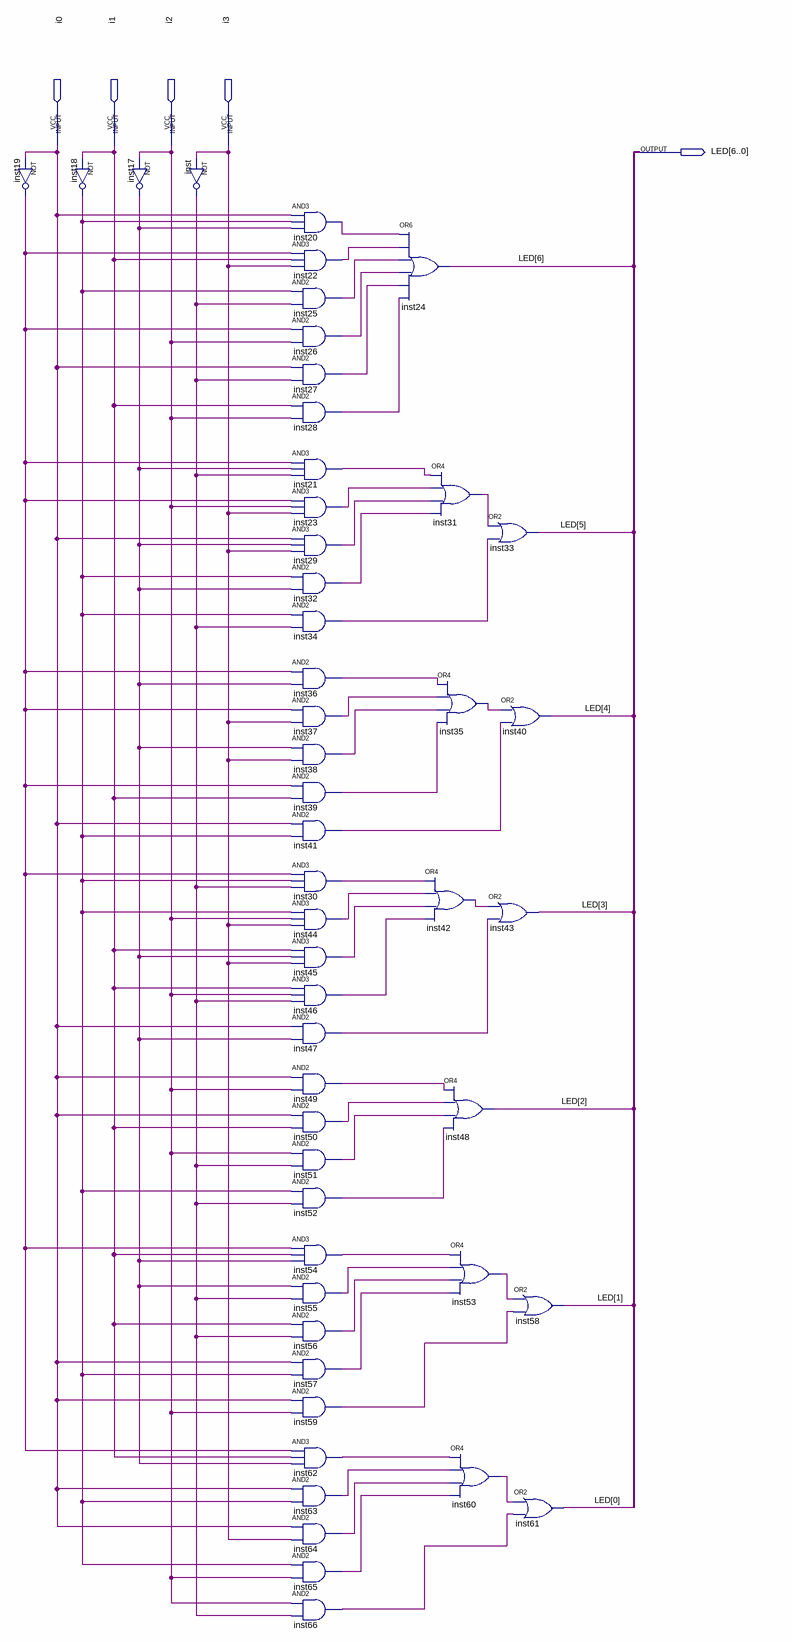
[diagram p0: schematic sheet]
// Quartus schematic 7segmentdisplay.bdf as structural Verilog: 51 symbols, 5 pins
module \7segmentdisplay  (
  input  i0,
  input  i1,
  input  i2,
  input  i3,
  output [6:0] LED
);

  wire inst17_out, inst18_out, inst19_out, inst20_out, inst21_out, inst22_out, inst23_out, inst25_out,
       inst26_out, inst27_out, inst28_out, inst29_out, inst30_out, inst31_out, inst32_out, inst34_out,
       inst35_out, inst36_out, inst37_out, inst38_out, inst39_out, inst41_out, inst42_out, inst44_out,
       inst45_out, inst46_out, inst47_out, inst49_out, inst50_out, inst51_out, inst52_out, inst53_out,
       inst54_out, inst55_out, inst56_out, inst57_out, inst59_out, inst60_out, inst62_out, inst63_out,
       inst64_out, inst65_out, inst66_out, inst_out;

  not inst19 (inst19_out, i0);
  not inst18 (inst18_out, i1);
  not inst17 (inst17_out, i2);
  not inst (inst_out, i3);
  and inst20 (inst20_out, i0, inst18_out, inst17_out);
  and inst22 (inst22_out, inst19_out, i1, i3);
  and inst25 (inst25_out, inst18_out, inst_out);
  and inst26 (inst26_out, inst19_out, i2);
  and inst27 (inst27_out, i0, inst_out);
  and inst28 (inst28_out, i1, i2);
  and inst21 (inst21_out, inst19_out, inst17_out, inst_out);
  and inst23 (inst23_out, inst19_out, i2, i3);
  and inst29 (inst29_out, i0, inst17_out, i3);
  and inst32 (inst32_out, inst18_out, inst17_out);
  and inst34 (inst34_out, inst18_out, inst_out);
  and inst36 (inst36_out, inst19_out, inst17_out);
  and inst37 (inst37_out, inst19_out, i3);
  and inst38 (inst38_out, inst17_out, i3);
  and inst39 (inst39_out, inst19_out, i1);
  and inst41 (inst41_out, i0, inst18_out);
  and inst30 (inst30_out, inst19_out, inst18_out, inst_out);
  and inst44 (inst44_out, inst18_out, i2, i3);
  and inst45 (inst45_out, i1, inst17_out, i3);
  and inst46 (inst46_out, i1, i2, inst_out);
  and inst47 (inst47_out, i0, inst17_out);
  and inst49 (inst49_out, i0, i2);
  and inst50 (inst50_out, i0, i1);
  and inst51 (inst51_out, i2, inst_out);
  and inst52 (inst52_out, inst18_out, inst_out);
  and inst54 (inst54_out, inst19_out, i1, inst17_out);
  and inst55 (inst55_out, inst17_out, inst_out);
  and inst56 (inst56_out, i1, inst_out);
  and inst57 (inst57_out, i0, inst18_out);
  and inst59 (inst59_out, i0, i2);
  and inst62 (inst62_out, inst19_out, i1, inst17_out);
  and inst63 (inst63_out, i0, inst18_out);
  and inst64 (inst64_out, i0, i3);
  and inst65 (inst65_out, inst18_out, i2);
  and inst66 (inst66_out, i2, inst_out);
  or inst24 (LED[6], inst20_out, inst22_out, inst25_out, inst26_out, inst27_out, inst28_out);
  or inst31 (inst31_out, inst21_out, inst23_out, inst29_out, inst32_out);
  or inst35 (inst35_out, inst36_out, inst37_out, inst38_out, inst39_out);
  or inst42 (inst42_out, inst30_out, inst44_out, inst45_out, inst46_out);
  or inst48 (LED[2], inst49_out, inst50_out, inst51_out, inst52_out);
  or inst53 (inst53_out, inst54_out, inst55_out, inst56_out, inst57_out);
  or inst60 (inst60_out, inst62_out, inst63_out, inst64_out, inst65_out);
  or inst33 (LED[5], inst31_out, inst34_out);
  or inst40 (LED[4], inst35_out, inst41_out);
  or inst43 (LED[3], inst42_out, inst47_out);
  or inst58 (LED[1], inst53_out, inst59_out);
  or inst61 (LED[0], inst60_out, inst66_out);
endmodule
